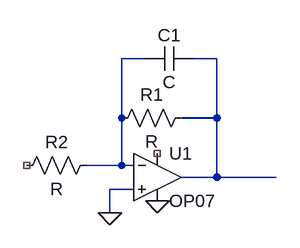
[diagram p0: schematic LPF.asc]
LPF.asc, the LTspice schematic file:
Version 4
SHEET 1 880 680
WIRE 304 16 272 16
WIRE 400 16 368 16
WIRE 272 96 272 16
WIRE 400 96 400 16
WIRE 400 96 352 96
WIRE 272 160 272 96
WIRE 272 160 224 160
WIRE 288 160 272 160
WIRE 400 176 400 96
WIRE 400 176 352 176
WIRE 480 176 400 176
WIRE 288 192 256 192
WIRE 256 224 256 192
FLAG 320 208 0
FLAG 256 224 0
SYMBOL OpAmps\\OP07 320 112 R0
SYMATTR InstName U1
SYMBOL res 368 80 R90
WINDOW 0 0 56 VBottom 2
WINDOW 3 32 56 VTop 2
SYMATTR InstName R1
SYMBOL res 240 144 R90
WINDOW 0 0 56 VBottom 2
WINDOW 3 32 56 VTop 2
SYMATTR InstName R2
SYMBOL cap 368 0 R90
WINDOW 0 0 32 VBottom 2
WINDOW 3 32 32 VTop 2
SYMATTR InstName C1

The netlist it stands for:
* LPF.asc
XU1 0 N001 NC_01 0 N002 LT1001  ; OP07, pins In+ In- V+ V- OUT
R1 N002 N001 R
R2 N001 NC_02 R
C1 N002 N001 C
.lib LTC.lib
.backanno
.end